# Altium schematic sheet Relay 5V and Valve.SchDoc
size A4; SheetNumber: 5; SheetTotal: 9
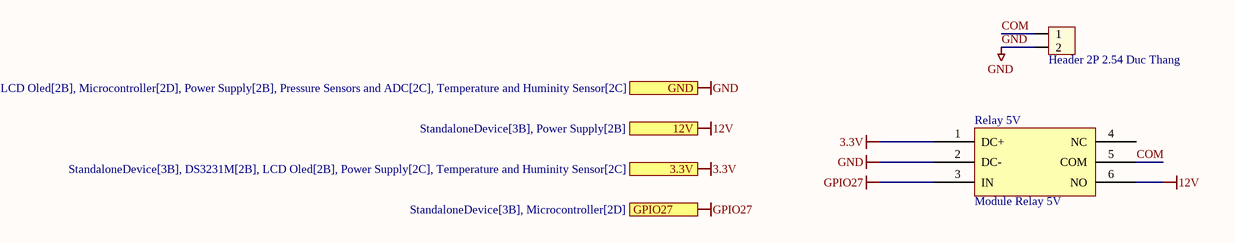
[diagram p0: Relay 5V and Valve.SchDoc]

## Parts
Relay_5V  Module Relay 5V  [Module Relay 5V]
Van  Header 2P 2.54 Duc Thang  [XH2.54M-2]

## Ports
3.3V (see StandaloneDevice[3B], DS3231M[2B], LCD Oled[2B], Power Supply[2C], Temperature and Huminity Sensor[2C]), 12V (see StandaloneDevice[3B], Power Supply[2B]), GND (see StandaloneDevice[3A], DS3231M[2B], LCD Oled[2B], Microcontroller[2D], Power Supply[2B], Pressure Sensors and ADC[2C], Temperature and Huminity Sensor[2C]), GPIO27 (see StandaloneDevice[3B], Microcontroller[2D])

## Nets
3.3V: Relay_5V.1(DC+) ; port 3.3V
12V: Relay_5V.6(NO) ; port 12V
GND: Relay_5V.2(DC-) Van.2 ; port GND
GPIO27: Relay_5V.3(IN) ; port GPIO27
COM: Relay_5V.5(COM) Van.1

Not connected (* = marked no-connect by the designer): Relay_5V 4(NC)

## Library data of the parts
Van = Header 2P 2.54 Duc Thang: Cắm; Ten_Linh_Kien: Header 2P XH2.54-2P Đực Thẳng; Don_Vi: Con; Ma_Hang: MH001283; Chung_Loai: Cắm